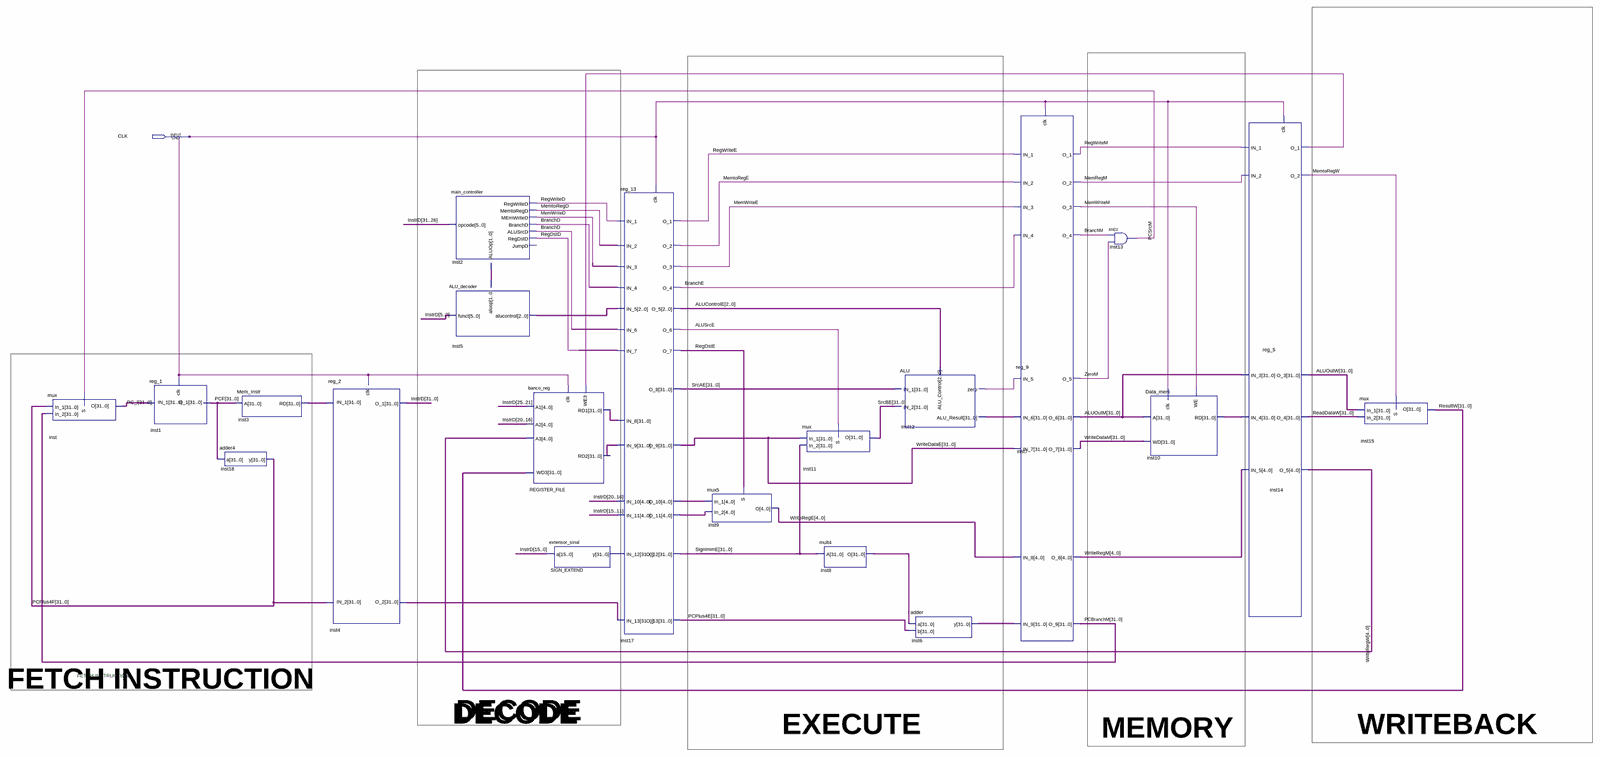
[diagram p0: schematic sheet, whole]
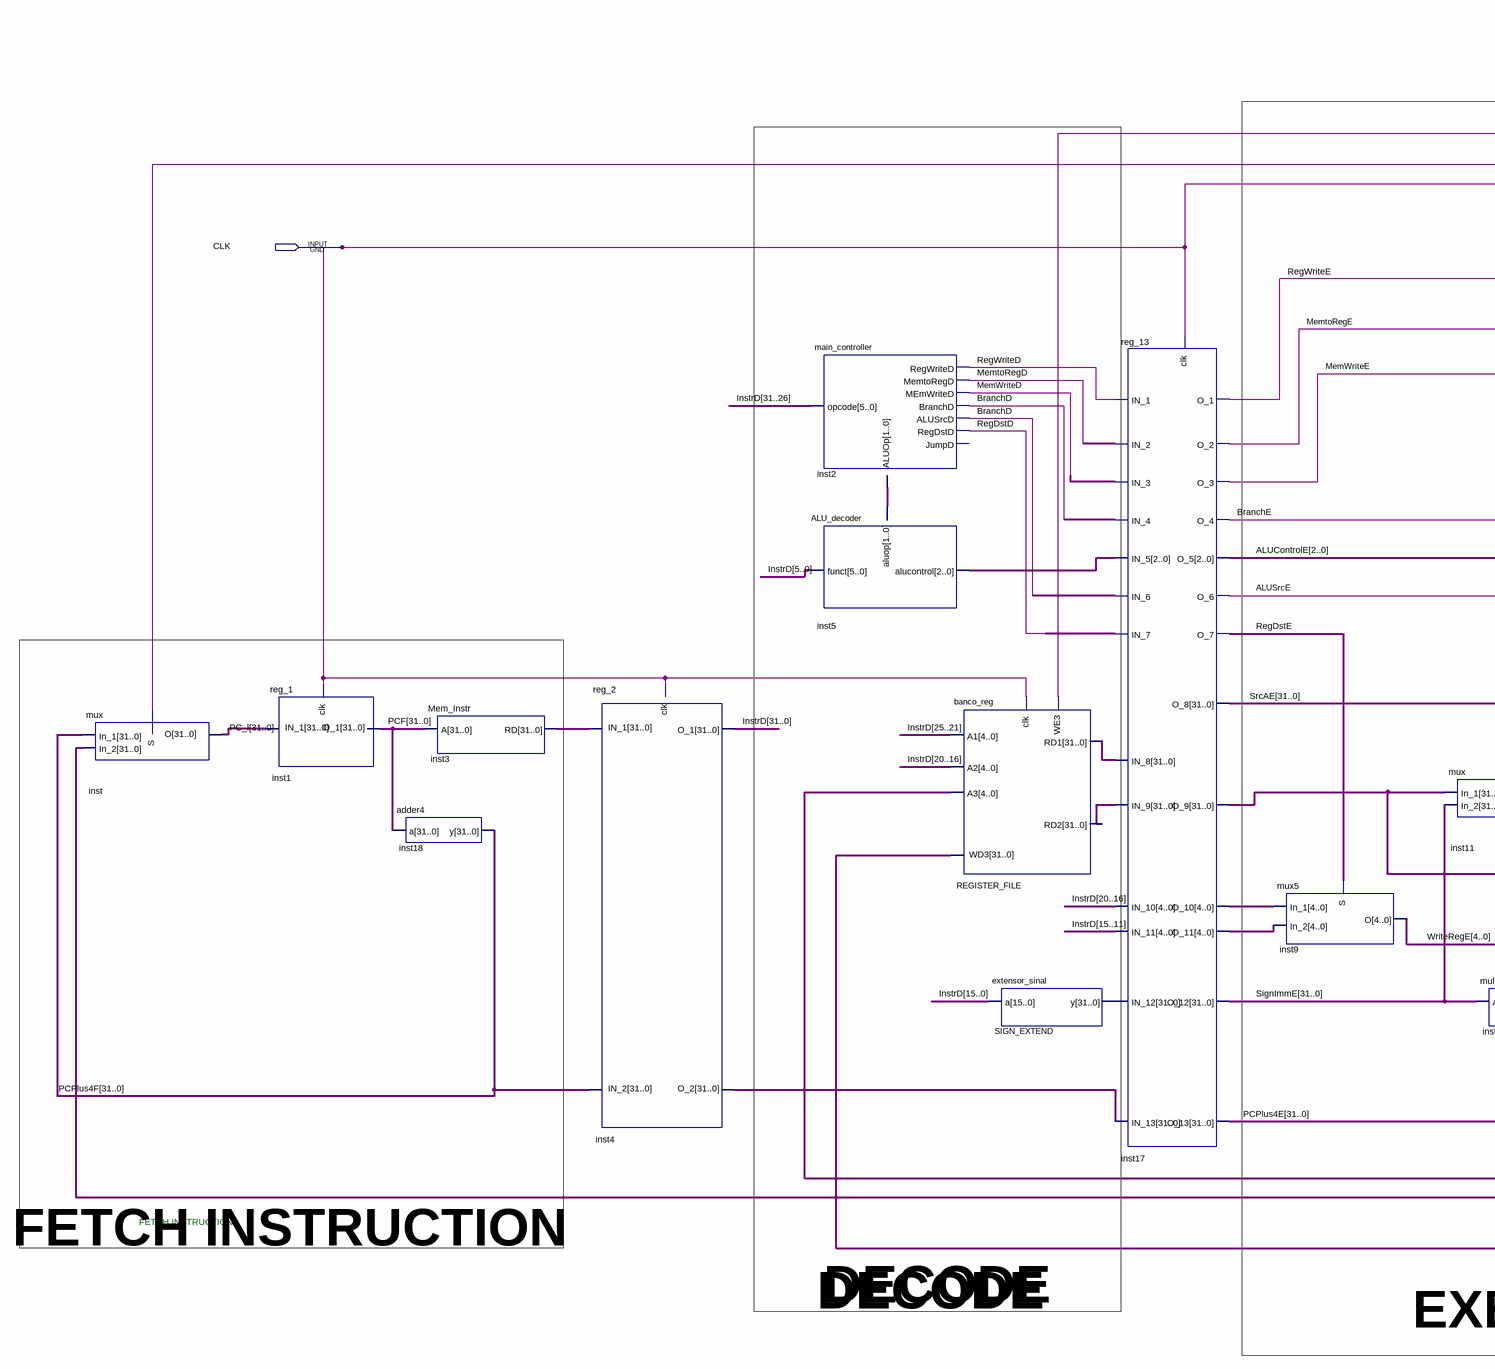
[diagram p1: schematic sheet, left part]
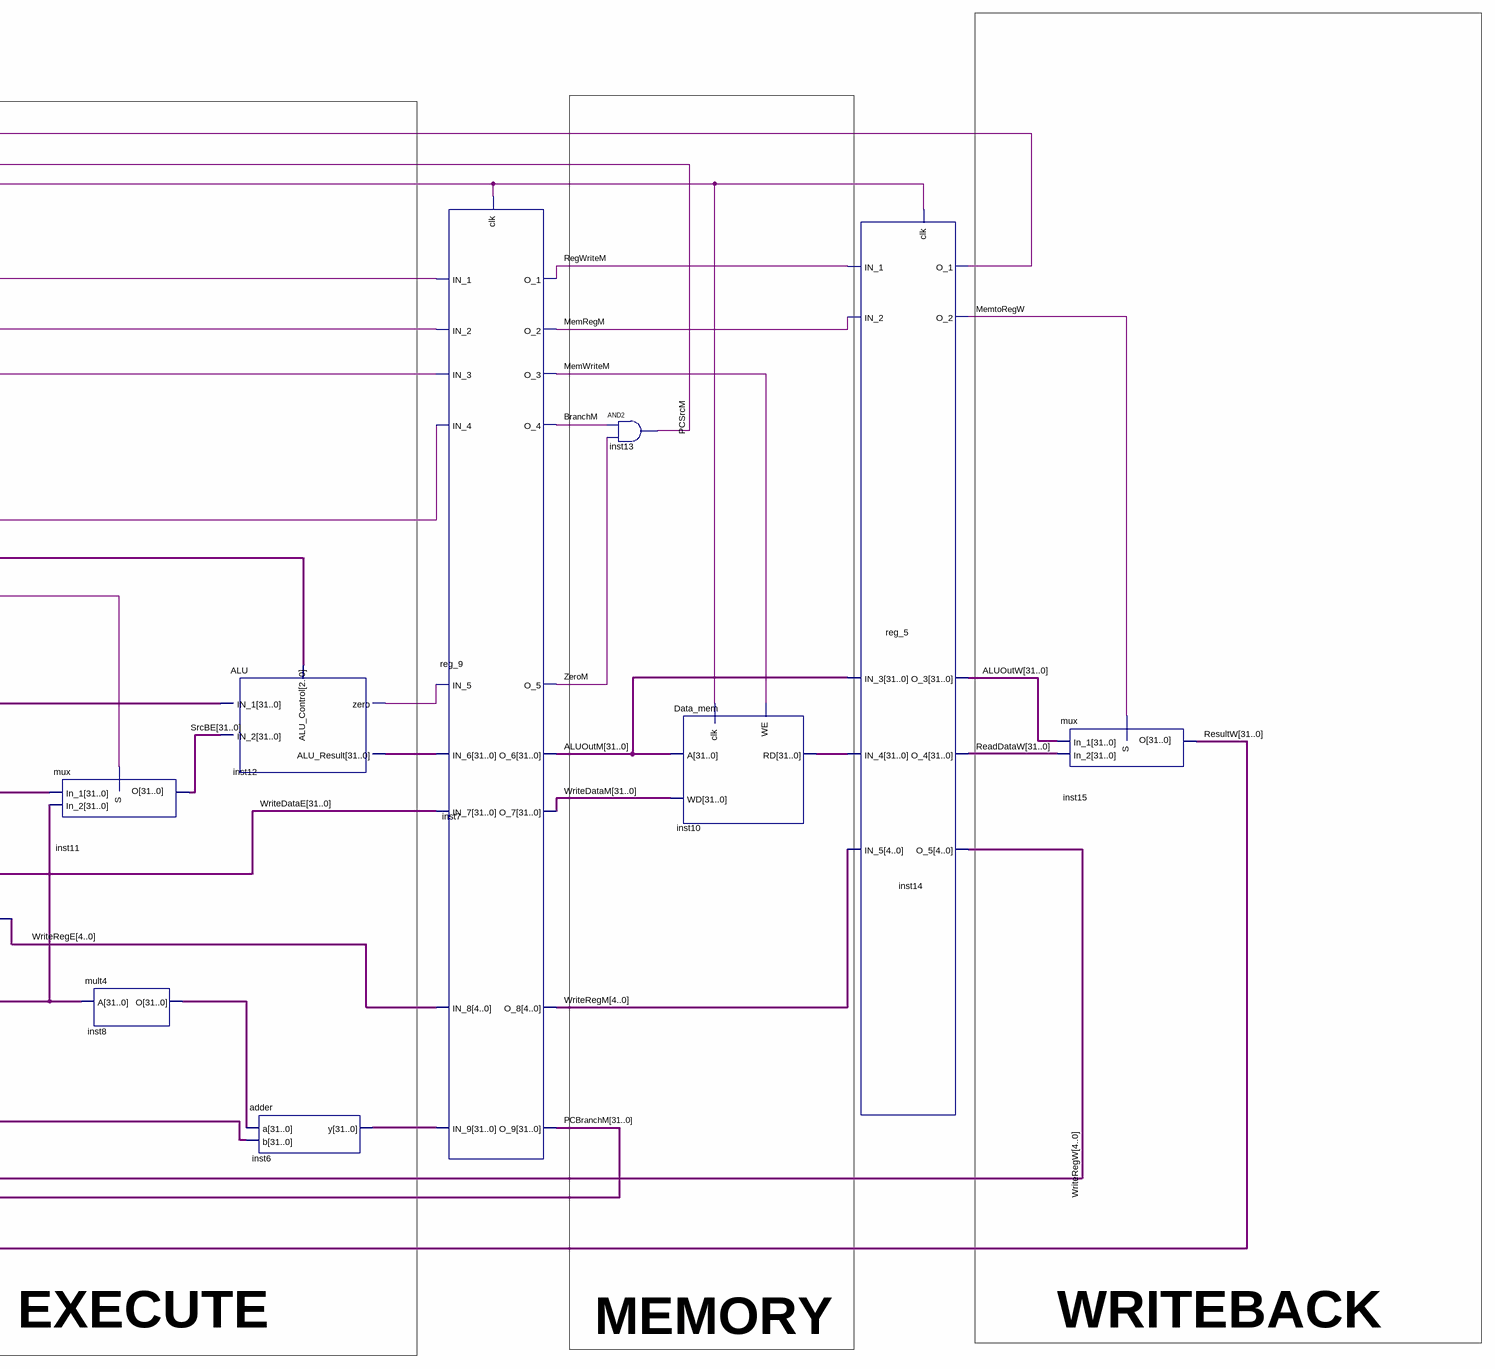
[diagram p2: schematic sheet, right part]
// Quartus schematic Processador_Pipeline.bdf as structural Verilog: 20 symbols, 1 pins
module Processador_Pipeline (
  input  CLK
);

  wire ALUSrcE, BranchD, BranchE, BranchM, inst12_zero, inst14_o_1, MemRegM, MemtoRegD, MemtoRegE, MemtoRegW,
       MemWriteD, MemWriteE, MemWriteM, PCSrcM, RegDstD, RegDstE, RegWriteD, RegWriteE, RegWriteM, undriven,
       undriven_2, undriven_3, undriven_4, undriven_5, ZeroM;
  wire [1:0] inst2_aluop;
  wire [2:0] ALUControlE, inst5_alucontrol;
  wire [4:0] inst17_o_10, inst17_o_11, WriteRegE, WriteRegM, WriteRegW;
  wire [31:0] ALUOutM, ALUOutW, inst3_rd, inst4_o_2, inst6_y, inst8_o, inst10_rd, inst12_alu_result, InstrD,
       PC_l, PCBranchM, PCF, PCPlus4E, PCPlus4F, ReadDataW, REGISTER_FILE_rd1, REGISTER_FILE_rd2, ResultW,
       SIGN_EXTEND_y, SignImmE, SrcAE, SrcBE, WriteDataE, WriteDataM;

  mux inst (.In_1(PCPlus4F), .In_2(PCBranchM), .S(PCSrcM), .O(PC_l));
  reg_1 inst1 (.IN_1(PC_l), .clk(CLK), .O_1(PCF));
  adder4 inst18 (.a(PCF), .y(PCPlus4F));
  Mem_Instr inst3 (.A(PCF), .RD(inst3_rd));
  reg_2 inst4 (.IN_1(inst3_rd), .IN_2(PCPlus4F), .clk(CLK), .O_1(InstrD), .O_2(inst4_o_2));
  main_controller inst2 (
    .opcode(InstrD[31:26]), .RegWriteD(RegWriteD), .MemtoRegD(MemtoRegD), .MEmWriteD(MemWriteD),
    .BranchD(BranchD), .ALUSrcD(BranchD), .RegDstD(RegDstD), .ALUOp(inst2_aluop));  // open: JumpD
  ALU_decoder inst5 (.funct(InstrD[5:0]), .aluop(inst2_aluop), .alucontrol(inst5_alucontrol));
  banco_reg REGISTER_FILE (
    .clk(CLK), .A1(InstrD[25:21]), .A2(InstrD[20:16]), .A3(WriteRegW), .WD3(ResultW), .WE3(inst14_o_1),
    .RD1(REGISTER_FILE_rd1), .RD2(REGISTER_FILE_rd2));
  extensor_sinal SIGN_EXTEND (.a(InstrD[15:0]), .y(SIGN_EXTEND_y));
  reg_13 inst17 (
    .IN_1(RegWriteD), .IN_2(undriven_2), .IN_3(undriven), .IN_4(undriven_3), .IN_6(undriven_4),
    .IN_7(undriven_5), .IN_5(inst5_alucontrol), .IN_8(REGISTER_FILE_rd1), .IN_9(REGISTER_FILE_rd2),
    .IN_12(SIGN_EXTEND_y), .IN_13(inst4_o_2), .IN_10(InstrD[20:16]), .IN_11(InstrD[15:11]), .clk(CLK),
    .O_1(RegWriteE), .O_2(MemtoRegE), .O_3(MemWriteE), .O_4(BranchE), .O_6(ALUSrcE), .O_7(RegDstE),
    .O_5(ALUControlE), .O_8(SrcAE), .O_9(WriteDataE), .O_12(SignImmE), .O_13(PCPlus4E), .O_10(inst17_o_10),
    .O_11(inst17_o_11));
  mux5 inst9 (.In_1(inst17_o_10), .In_2(inst17_o_11), .S(RegDstE), .O(WriteRegE));
  mux inst11 (.In_1(WriteDataE), .In_2(SignImmE), .S(ALUSrcE), .O(SrcBE));
  mult4 inst8 (.A(SignImmE), .O(inst8_o));
  ALU inst12 (
    .ALU_Control(ALUControlE), .IN_1(SrcAE), .IN_2(SrcBE), .zero(inst12_zero), .ALU_Result(inst12_alu_result));
  adder inst6 (.a(inst8_o), .b(PCPlus4E), .y(inst6_y));
  reg_9 inst7 (
    .IN_1(RegWriteE), .IN_2(MemtoRegE), .IN_3(MemWriteE), .IN_4(BranchE), .IN_5(inst12_zero),
    .IN_6(inst12_alu_result), .IN_7(WriteDataE), .IN_9(inst6_y), .IN_8(WriteRegE), .clk(CLK),
    .O_1(RegWriteM), .O_2(MemRegM), .O_3(MemWriteM), .O_4(BranchM), .O_5(ZeroM), .O_6(ALUOutM),
    .O_7(WriteDataM), .O_9(PCBranchM), .O_8(WriteRegM));
  and inst13 (PCSrcM, BranchM, ZeroM);
  Data_mem inst10 (.A(ALUOutM), .WD(WriteDataM), .clk(CLK), .WE(MemWriteM), .RD(inst10_rd));
  reg_5 inst14 (
    .IN_1(RegWriteM), .IN_2(MemRegM), .IN_3(ALUOutM), .IN_4(inst10_rd), .IN_5(WriteRegM), .clk(CLK),
    .O_1(inst14_o_1), .O_2(MemtoRegW), .O_3(ALUOutW), .O_4(ReadDataW), .O_5(WriteRegW));
  mux inst15 (.In_1(ALUOutW), .In_2(ReadDataW), .S(MemtoRegW), .O(ResultW));

  // Notes on the sheet:
  //   FETCH INSTRUCTION
  //   FETCH INSTRUCTION
  //   DECODE
  //   DECODE
  //   EXECUTE
  //   WRITEBACK
  //   MEMORY
endmodule
